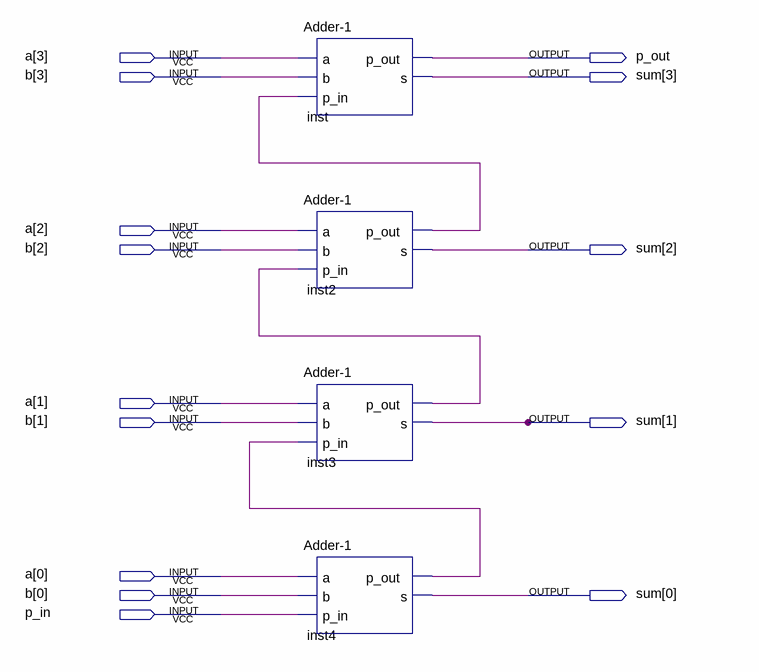
[diagram p0: schematic sheet]
// Quartus schematic a_adder_4.bdf as structural Verilog: 4 symbols, 14 pins
module a_adder_4 (
  input  [3:0] a,
  input  [3:0] b,
  input  p_in,
  output p_out,
  output [3:0] sum
);

  wire inst2_p_out, inst3_p_out, inst4_p_out;

  \Adder-1  inst (.a(a[3]), .b(b[3]), .p_in(inst2_p_out), .p_out(p_out), .s(sum[3]));
  \Adder-1  inst2 (.a(a[2]), .b(b[2]), .p_in(inst3_p_out), .p_out(inst2_p_out), .s(sum[2]));
  \Adder-1  inst3 (.a(a[1]), .b(b[1]), .p_in(inst4_p_out), .p_out(inst3_p_out), .s(sum[1]));
  \Adder-1  inst4 (.a(a[0]), .b(b[0]), .p_in(p_in), .p_out(inst4_p_out), .s(sum[0]));
endmodule
